# EAGLE design M452sx (EAGLE 6.6.0)
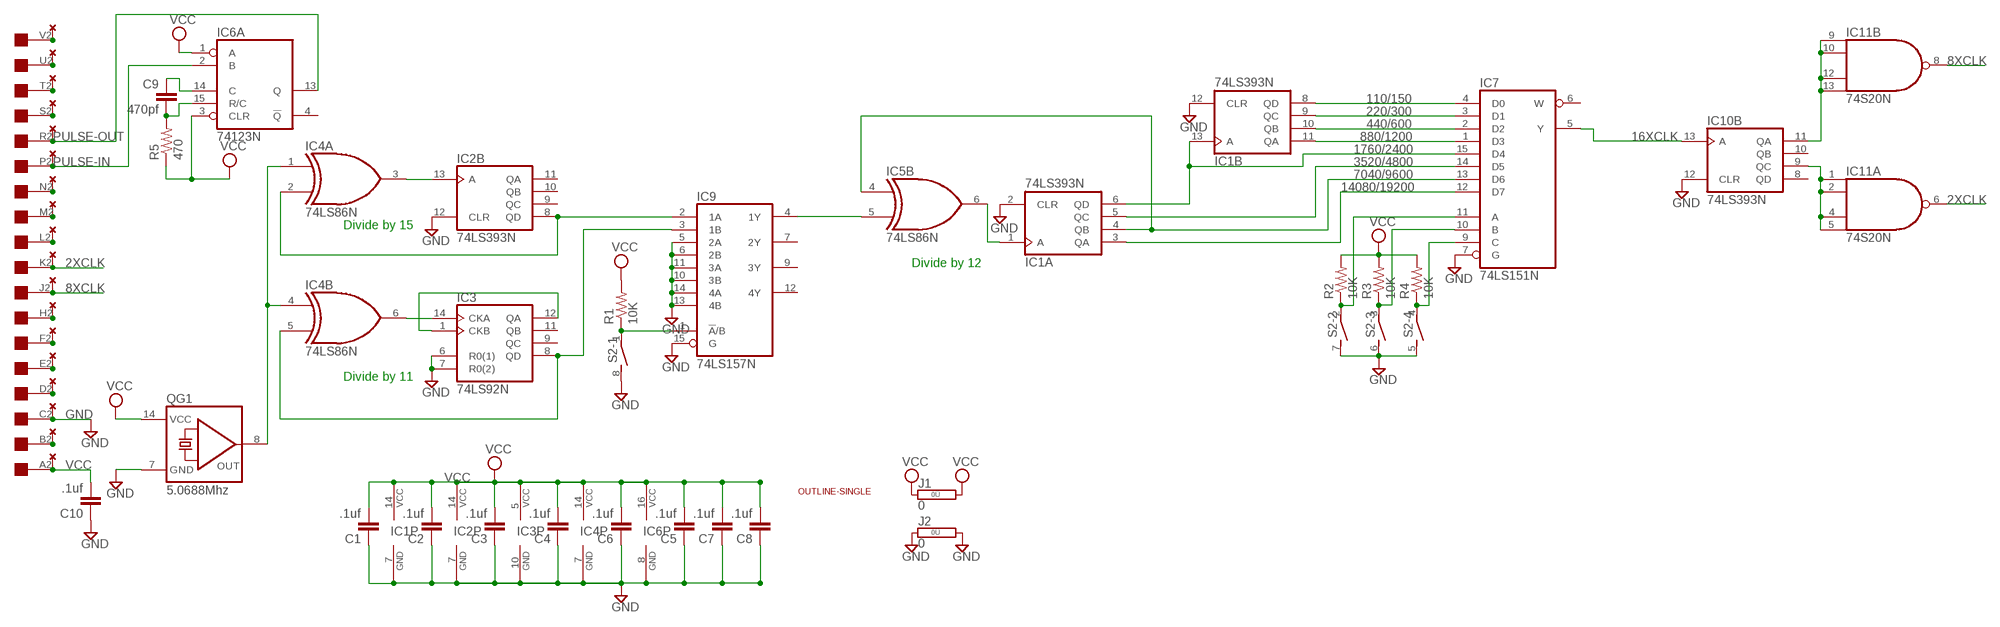
[diagram p0: schematic, sheet 1]

## Parts
C1  .1uf  C-EU050-025X075  [C050-025X075]
C2  .1uf  C-EU050-025X075  [C050-025X075]
C3  .1uf  C-EU050-025X075  [C050-025X075]
C4  .1uf  C-EU050-025X075  [C050-025X075]
C5  .1uf  C-EU050-025X075  [C050-025X075]
C6  .1uf  C-EU050-025X075  [C050-025X075]
C7  .1uf  C-EU050-025X075  [C050-025X075]
C8  .1uf  C-EU050-025X075  [C050-025X075]
C9  470pf  C-EU050-025X075  [C050-025X075]
C10  .1uf  C-EU050-025X075  [C050-025X075]
IC1  74LS393N  [DIL14]
IC2  74LS393N  [DIL14]
IC3  74LS92N  [DIL14]
IC4  74LS86N  [DIL14]
IC5  74LS86N  [DIL14]
IC6  74123N  [DIL16]
IC7  74LS151N  74151N  [DIL16]
IC9  74LS157N  [DIL16]
IC10  74LS393N  [DIL14]
IC11  74S20N  [DIL14]
J1  0  0R  [0R/10]
J2  0  0R  [0R/10]
QG1  5.0688Mhz  QG5860  [DIL14S]
R1  10K  R-US_0204/7  [0204/7]
R2  10K  R-US_0204/7  [0204/7]
R3  10K  R-US_0204/7  [0204/7]
R4  10K  R-US_0204/7  [0204/7]
R5  470  R-US_0204/7  [0204/7]
S2  DIP04S  [DIP04S]
U$2  THRU-HOLE1  [THRU-HOLE1]
U$3  OUTLINE-SINGLE  [SINGLE]
U$4  EDGE-1  [EDGE-CON1]

## Nets
2XCLK: IC11.6(A:O) U$2.K2 U$4.K2
8XCLK: IC11.8(B:O) U$2.J2 U$4.J2
16XCLK: IC7.5(Y) IC10.13(B:A)
110/150: IC1.8(B:QD) IC7.4(D0)
220/300: IC1.9(B:QC) IC7.3(D1)
440/600: IC1.10(B:QB) IC7.2(D2)
880/1200: IC1.11(B:QA) IC7.1(D3)
1760/2400: IC1.6(A:QD) IC1.13(B:A) IC7.15(D4)
3520/4800: IC1.5(A:QC) IC7.14(D5)
7040/9600: IC1.4(A:QB) IC5.4(B:I0) IC7.13(D6)
14080/19200: IC1.3(A:QA) IC7.12(D7)
GND: C1.1 C2.1 C3.1 C4.1 C5.1 C6.1 C7.1 C8.1 C10.1 IC1.2(A:CLR) IC1.7(P:GND) IC1.12(B:CLR) IC2.7(P:GND) IC2.12(B:CLR) IC3.6(R0(1)) IC3.7(R0(2)) IC3.10(GND) IC4.7(P:GND) IC6.8(P:GND) IC7.7(G) IC9.5(2A) IC9.6(2B) IC9.10(3B) IC9.11(3A) IC9.13(4B) IC9.14(4A) IC9.15(G) IC10.12(B:CLR) J2.1 J2.2 QG1.7(GND) S2.5 S2.6 S2.7 S2.8 U$2.C2 U$4.C2
N$1: IC4.1(A:I0) IC4.4(B:I0) QG1.8(OUT)
N$2: IC2.8(B:QD) IC4.2(A:I1) IC9.2(1A)
N$3: IC3.8(QD) IC4.5(B:I1) IC9.3(1B)
N$4: IC3.1(CKB) IC3.12(QA)
N$5: IC3.14(CKA) IC4.6(B:O)
N$6: IC2.13(B:A) IC4.3(A:O)
N$7: U$2.H2 U$4.H2
N$8: IC7.11(A) R2.1 S2.2
N$9: IC5.5(B:I1) IC9.4(1Y)
N$10: IC10.9(B:QC) IC11.1(A:I0) IC11.2(A:I1) IC11.4(A:I2) IC11.5(A:I3)
N$11: IC1.1(A:A) IC5.6(B:O)
N$12: IC10.11(B:QA) IC11.9(B:I0) IC11.10(B:I1) IC11.12(B:I2) IC11.13(B:I3)
N$13: IC7.10(B) R3.1 S2.3
N$14: IC7.9(C) R4.1 S2.4
N$15: U$2.L2 U$4.L2
N$16: U$2.M2 U$4.M2
N$17: IC9.1(!A!/B) R1.1 S2.1
N$18: U$2.N2 U$4.N2
N$19: U$2.F2 U$4.F2
N$20: U$2.E2 U$4.E2
N$21: C9.2 IC6.15(A:R/C) R5.2
N$22: C9.1 IC6.14(A:C)
N$23: U$2.D2 U$4.D2
N$24: U$2.S2 U$4.S2
N$25: U$2.B2 U$4.B2
N$26: U$2.T2 U$4.T2
N$27: U$2.U2 U$4.U2
N$28: U$2.V2 U$4.V2
PULSE-IN: IC6.2(A:B) U$2.P2 U$4.P2
PULSE-OUT: IC6.13(A:Q) U$2.R2 U$4.R2
VCC: C1.2 C2.2 C3.2 C4.2 C5.2 C6.2 C7.2 C8.2 C10.2 IC1.14(P:VCC) IC2.14(P:VCC) IC3.5(VCC) IC4.14(P:VCC) IC6.1(A:A) IC6.3(A:CLR) IC6.16(P:VCC) J1.1 J1.2 QG1.14(VCC) R1.2 R2.2 R3.2 R4.2 R5.1 U$2.A2 U$4.A2
Unconnected: IC2.1(A:A) IC2.2(A:CLR) IC2.3(A:QA) IC2.4(A:QB) IC2.5(A:QC) IC2.6(A:QD) IC2.9(B:QC) IC2.10(B:QB) IC2.11(B:QA) IC3.9(QC) IC3.11(QB) IC4.8(C:O) IC4.9(C:I0) IC4.10(C:I1) IC4.11(D:O) IC4.12(D:I0) IC4.13(D:I1) IC5.1(A:I0) IC5.2(A:I1) IC5.3(A:O) IC5.8(C:O) IC5.9(C:I0) IC5.10(C:I1) IC5.11(D:O) IC5.12(D:I0) IC5.13(D:I1) IC6.4(A:!Q) IC6.5(B:Q) IC6.6(B:C) IC6.7(B:R/C) IC6.9(B:A) IC6.10(B:B) IC6.11(B:CLR) IC6.12(B:!Q) IC7.6(W) IC9.7(2Y) IC9.9(3Y) IC9.12(4Y) IC10.1(A:A) IC10.2(A:CLR) IC10.3(A:QA) IC10.4(A:QB) IC10.5(A:QC) IC10.6(A:QD) IC10.8(B:QD) IC10.10(B:QB)

## Notes on the sheet
- Divide by 15
- Divide by 12
- Divide by 11

## Power pins joined to a net without a drawn wire
GND: IC5.7(P:GND) IC7.8(GND) IC9.8(GND) IC10.7(P:GND) IC11.7(P:GND)
VCC: IC5.14(P:VCC) IC7.16(VCC) IC9.16(VCC) IC10.14(P:VCC) IC11.14(P:VCC)

## Library data of the parts
C1-C10 = rcl:C-EU: CAPACITOR, European symbol
IC1 IC2 IC10 = 74xx-us:74*393: Dual 4-bit decade and binary COUNTER
IC3 = 74xx-us:74*92: Decade, divide by twelve and binary COUNTER
IC4 IC5 = 74xx-us:74*86: Quad 2-input EXCLUSIV-OR (XOR) gate
IC6 = 74xx-us:74*123: Retriggerable monostable MULTIVIBRATOR
IC7 = 74xx-us:74*151: Data SELECTOR/MULTIPLEXER
IC9 = 74xx-us:74*157: Quadruple 2-line to 1-line data SELECTOR/MULTIPLEXER
IC11 = 74xx-us:74*20: Dual 4-input NAND gate
J1 J2 = jumper:0R: Bridge 0R 10mm
QG1 = crystal:QG5860: CRYSTAL RESONATOR; OC_FARNELL: unknown; OC_NEWARK: unknown
R1-R5 = rcl:R-US_: RESISTOR, American symbol
S2 = switch-dil:DIP04S: DIL/CODE SWITCH; OC_FARNELL: unknown; OC_NEWARK: unknown
U$2 = dec-con:THRU-HOLE1: Thru-Hole addition to double-sided edge connector.
U$3 = dec-con:OUTLINE-*: Board outlines for DEC boards.
U$4 = dec-con:EDGE-1: Single-Sided DEC Edge Connector -- (side 2)

## Board
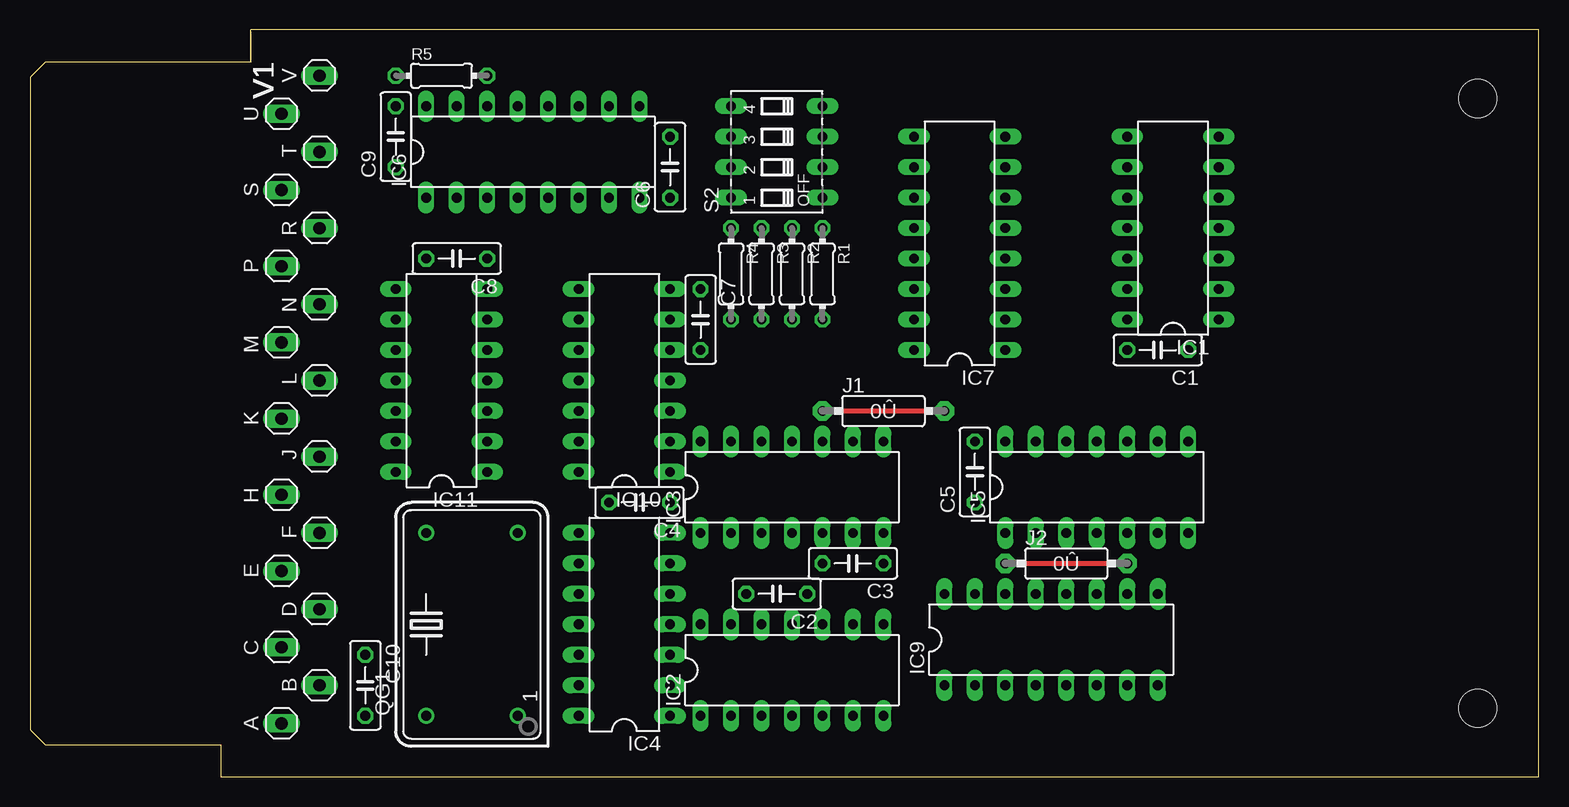
[diagram p1: board, top side]
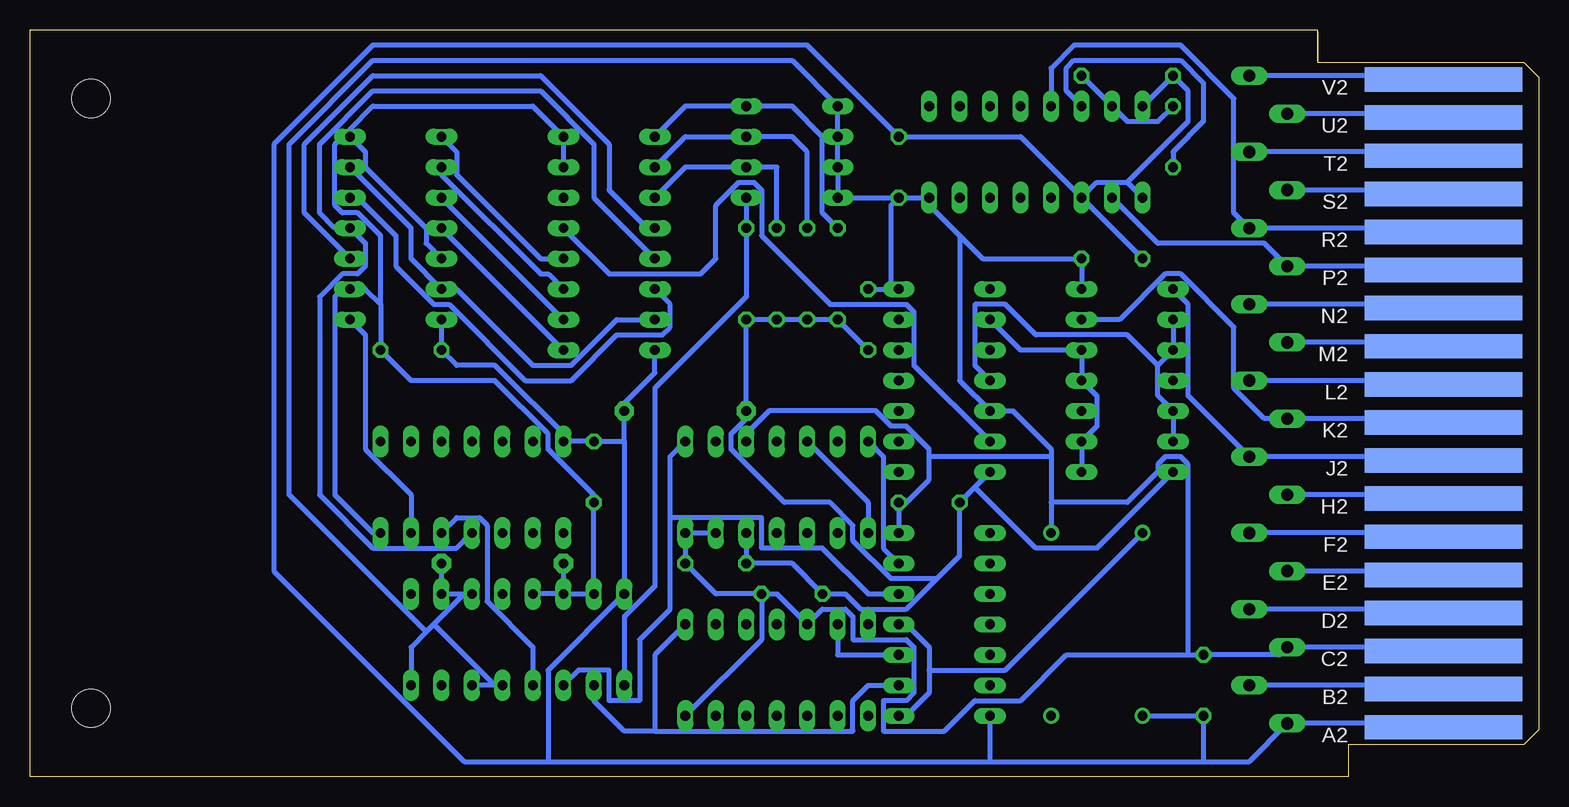
[diagram p2: board, bottom side, seen from below]

Size 125.73 x 62.23 mm. Coordinates in mm from the lower left corner, seen from the top.
Copper layers (1+16): Top 0.035mm / dielectric 1.5mm / Bottom 0.035mm
Design rules "16mils": minimum track width 16mil, minimum drill 32mil, track to track 15mil, track to pad 10mil, pad to pad 10mil, via to via 10mil, smd to smd 10mil, copper to edge 13mil, drill to drill 10mil, minimum pad ring 10mil, minimum via ring 8mil, stop-mask expansion 0mil, vias tented up to drill 0mil, thermal gap 10mil

### Footprints (pad centres in the part's own frame; a part is rotated, then mirrored left to right if it is on the bottom)
C050-025X075 = drill 0.813 octagon: 1 -2.54,0; 2 2.54,0
DIL14 = drill 0.813 long: 1 -7.62,-3.81; 2 -5.08,-3.81; 3 -2.54,-3.81; 4 0,-3.81; 5 2.54,-3.81; 6 5.08,-3.81; 7 7.62,-3.81; 8 7.62,3.81; 9 5.08,3.81; 10 2.54,3.81; 11 0,3.81; 12 -2.54,3.81; 13 -5.08,3.81; 14 -7.62,3.81
DIL16 = drill 0.813 long: 1 -8.89,-3.81; 2 -6.35,-3.81; 3 -3.81,-3.81; 4 -1.27,-3.81; 5 1.27,-3.81; 6 3.81,-3.81; 7 6.35,-3.81; 8 8.89,-3.81; 9 8.89,3.81; 10 6.35,3.81; 11 3.81,3.81; 12 1.27,3.81; 13 -1.27,3.81; 14 -3.81,3.81; 15 -6.35,3.81; 16 -8.89,3.81
0R/10 = drill 0.813 pad 1.6 octagon: 1 -5.08,0; 2 5.08,0
DIL14S = drill 0.813: 1 -7.62,-3.81; 7 7.62,-3.81; 8 7.62,3.81; 14 -7.62,3.81
0204/7 = drill 0.813 octagon: 1 -3.81,0; 2 3.81,0
DIP04S = drill 0.813 long: 1 -3.81,-3.81; 2 -1.27,-3.81; 3 1.27,-3.81; 4 3.81,-3.81; 5 3.81,3.81; 6 1.27,3.81; 7 -1.27,3.81; 8 -3.81,3.81
THRU-HOLE1 = drill 1.016 long: A2 28.575,3.175; B2 25.4,6.35; C2 22.225,3.175; D2 19.05,6.35; E2 15.875,3.175; F2 12.7,6.35; H2 9.525,3.175; J2 6.35,6.35; K2 3.175,3.175; L2 0,6.35; M2 -3.175,3.175; N2 -6.35,6.35; P2 -9.525,3.175; R2 -12.7,6.35; S2 -15.875,3.175; T2 -19.05,6.35; U2 -22.225,3.175; V2 -25.4,6.35
SINGLE = hole 3.175: 120.65,56.515; 120.65,5.715
EDGE-CON1 = smd 13.106 x 2.032 bottom: A2 7.938,4.128; B2 7.938,7.303; C2 7.938,10.477; D2 7.938,13.652; E2 7.938,16.828; F2 7.938,20.003; H2 7.938,23.177; J2 7.938,26.352; K2 7.938,29.527; L2 7.938,32.703; M2 7.938,35.877; N2 7.938,39.053; P2 7.938,42.227; R2 7.938,45.403; S2 7.938,48.578; T2 7.938,51.752; U2 7.938,54.928; V2 7.938,58.102

### Placement (x,y rotation side)
C1  93.98,35.56 180 top
C2  62.23,15.24 180 top
C3  68.58,17.78 180 top
C4  50.8,22.86 180 top
C5  78.74,25.4 90 top
C6  53.34,50.8 90 top
C7  55.88,38.1 270 top
C8  35.56,43.18 180 top
C9  30.48,53.34 90 top
C10  27.94,7.62 270 top
IC1  95.25,45.72 90 top
IC2  63.5,8.89 0 top
IC3  63.5,24.13 0 top
IC4  49.53,12.7 90 top
IC5  88.9,24.13 0 top
IC6  41.91,52.07 0 top
IC7  77.47,44.45 90 top
IC9  85.09,11.43 0 top
IC10  49.53,33.02 90 top
IC11  34.29,33.02 90 top
J1  71.12,30.48 0 top
J2  86.36,17.78 0 top
QG1  36.83,12.7 90 top
R1  66.04,41.91 270 top
R2  63.5,41.91 270 top
R3  60.96,41.91 270 top
R4  58.42,41.91 270 top
R5  34.29,58.42 0 top
S2  62.23,52.07 90 top
U$2  17.78,33.02 270 top
U$3  0,0 0 top
U$4  0,0 0 top

### Tracks (layer width: path | path; a pad name or v marks a point on that pad's centre or on a via)
2XCLK
  Bottom 0.406: U$4.K2 8.26,29.84 U$2.K2 22.86,29.84 25.4,32.38 25.4,37.47 29.85,41.91 31.12,41.91 34.93,38.1 IC11.6
8XCLK
  Bottom 0.406: IC11.8 29.21,39.37 29.21,31.75 U$2.J2 8.26,26.67 U$4.J2
16XCLK
  Bottom 0.406: IC7.5 77.47,41.91 69.85,41.91 68.58,43.18 68.58,47.62 66.68,49.53 65.41,49.53 64.77,48.9 64.77,45.09 59.06,39.37 52.71,39.37 52.07,38.73 52.07,34.29 IC10.13
110/150
  Bottom 0.406: IC7.4 83.19,43.18 90.17,50.16 90.17,52.07 IC1.8
220/300
  Bottom 0.406: IC7.3 82.55,41.91 83.19,41.91 91.44,50.16 IC1.9
440/600
  Bottom 0.406: IC1.10 IC7.2
880/1200
  Bottom 0.406: IC1.11 IC7.1
1760/2400
  Bottom 0.406: IC1.6 93.98,45.72 93.98,43.18 IC1.13 90.17,40.64 83.82,34.29 80.65,34.29 76.84,38.1 IC7.15
3520/4800
  Bottom 0.406: IC1.5 98.43,48.26 95.25,45.09 95.25,42.55 92.08,39.37 90.81,39.37 84.46,33.02 80.65,33.02 76.84,36.83 73.03,36.83 72.39,37.47 72.39,39.37 IC7.14
7040/9600
  Bottom 0.406: IC7.13 78.74,48.26 78.74,52.7 83.19,57.15 97.16,57.15 101.6,52.7 101.6,46.99 100.33,45.72 IC1.4 97.79,44.45 97.79,42.55 98.43,41.91 99.7,41.91 101.6,40.01 101.6,23.5 97.16,19.05 90.17,19.05 IC5.4
14080/19200
  Bottom 0.406: IC7.12 74.3,45.72 77.47,48.9 77.47,52.7 83.19,58.42 97.16,58.42 102.87,52.7 102.87,46.99 IC1.3
GND
  Top 0.406: J2.1 J2.2
  Bottom 0.406: 53.34,22.23 IC4.7 | 40.64,26.67 40.64,27.3 43.82,30.48 IC10.12 48.26,33.02 48.26,45.09 | 40.64,26.67 40.64,22.86 | 40.64,22.86 QG1.7 | IC11.7 C8.1 46.36,43.18 48.26,45.09 | C6.1 51.44,48.26 | 51.44,48.26 48.26,45.09 | 51.44,48.26 IC6.8 | C7.1 53.98,40.64 | C6.1 53.98,47.62 53.98,40.64 | 53.98,40.64 IC10.7 | IC1.12 92.71,44.45 92.71,45.72 97.79,50.8 97.79,52.07 IC1.7 | IC1.7 99.06,53.98 97.16,55.88 83.82,55.88 IC7.8 IC7.7 | U$4.C2 8.26,10.79 U$2.C2 21.59,10.16 C10.1 29.21,10.16 | IC5.7 97.16,20.32 100.33,23.5 100.33,40.01 99.7,40.64 IC1.2 97.79,40.64 96.52,39.37 | 96.52,39.37 C1.1 93.98,33.02 87,33.02 82.55,28.57 82.55,27.3 78.74,23.5 C5.1 IC9.15 IC9.14 | IC3.6 IC3.7 C3.1 68.58,15.24 C2.1 | C2.1 63.5,15.24 IC2.12 59.69,13.97 57.79,13.97 57.15,13.34 57.15,11.43 52.71,11.43 52.07,10.79 52.07,6.99 52.71,6.35 54.61,6.35 54.61,3.81 49.53,3.81 46.99,6.35 43.18,6.35 39.37,10.16 29.21,10.16 | 89.54,15.24 IC9.10 J2.2 | IC9.8 93.98,10.79 92.71,12.06 | 89.54,15.24 92.08,12.7 | 92.08,12.7 92.71,12.06 | 89.54,15.24 IC9.11 | 87,7.62 IC9.6 | 87,7.62 92.08,12.7 | 87,7.62 IC9.5 | IC1.7 99.7,53.34 100.33,52.7 100.33,47.62 99.7,46.99 98.43,46.99 96.52,45.09 96.52,39.37 | 40.64,22.86 34.29,22.86 31.75,25.4 31.75,26.04 31.12,26.67 29.85,26.67 29.21,26.04 29.21,10.16 | IC2.7 64.77,11.43 C2.1 | IC9.14 IC9.13 | 92.71,12.06 104.14,23.5 104.14,52.7 97.16,59.69 62.23,59.69 S2.5 S2.6 S2.7 S2.8 C6.1 | IC3.10 66.04,28.57 64.14,30.48 55.25,30.48 53.98,29.21 52.71,29.21 50.8,27.3 50.8,26.67 | 50.8,26.67 50.8,24.77 53.34,22.23 | 53.34,22.23 C4.1 | 40.64,26.67 50.8,26.67 | J2.1 IC9.14
N$1
  Bottom 0.406: IC4.1 52.71,5.08 50.8,6.99 50.8,8.89 | 50.8,8.89 50.8,10.79 52.71,12.7 IC4.4 | QG1.8 44.45,8.89 50.8,8.89
N$2
  Bottom 0.406: IC4.2 55.88,7.62 57.15,6.35 57.15,3.81 73.66,3.81 | IC2.8 73.66,10.16 73.66,3.81 | IC9.2 78.74,6.35 76.2,3.81 73.66,3.81
N$3
  Bottom 0.406: IC9.3 80.01,8.89 77.47,8.89 77.47,6.35 74.93,6.35 74.93,11.43 72.39,13.97 72.39,21.59 | 72.39,21.59 64.77,21.59 64.77,19.05 59.69,19.05 55.88,15.24 IC4.5 | 72.39,21.59 72.39,26.67 IC3.8
N$4
  Bottom 0.406: IC3.1 55.88,22.86 IC3.12
N$5
  Bottom 0.406: IC4.6 54.61,19.05 54.61,26.67 IC3.14
N$6
  Bottom 0.406: IC4.3 58.42,10.16 IC2.13
N$7
  Bottom 0.406: U$2.H2 8.26,23.5 U$4.H2
N$8
  Bottom 0.406: R2.1 63.5,50.8 S2.2 71.12,50.8 IC7.11
N$9
  Bottom 0.406: IC9.4 83.82,10.79 87.63,14.61 87.63,20.95 88.27,21.59 90.17,21.59 IC5.5
N$10
  Bottom 0.406: IC11.1 IC11.2 36.83,29.21 36.83,31.75 IC11.4 IC11.5 43.18,35.56 IC10.9
N$11
  Bottom 0.406: IC5.6 93.98,23.5 97.79,27.3 97.79,36.83 IC1.1
N$12
  Bottom 0.406: IC11.13 IC11.12 31.75,31.75 31.75,34.29 | IC11.9 IC11.10 31.75,34.29 | 31.75,34.29 34.29,36.83 41.91,36.83 44.45,39.37 46.99,39.37 46.99,34.29 IC10.11
N$13
  Bottom 0.406: IC7.10 71.12,53.34 S2.3 62.23,53.34 60.96,52.07 R3.1
N$14
  Bottom 0.406: IC7.9 71.12,55.88 S2.4 62.23,55.88 59.69,53.34 59.69,46.99 R4.1
N$15
  Bottom 0.406: U$2.L2 8.26,33.02 U$4.L2
N$16
  Bottom 0.406: U$2.M2 8.26,36.2 U$4.M2
N$17
  Bottom 0.406: S2.1 R1.1 66.04,40.01 73.66,32.38 73.66,15.88 76.2,13.34 IC9.1
N$18
  Bottom 0.406: U$2.N2 8.26,39.37 U$4.N2
N$19
  Bottom 0.406: U$2.F2 8.26,20.32 U$4.F2
N$20
  Bottom 0.406: U$2.E2 8.26,17.14 U$4.E2
N$21
  Bottom 0.406: C9.2 31.75,54.61 34.29,54.61 IC6.15 R5.2
N$22
  Bottom 0.406: C9.1 30.48,52.07 27.94,54.61 27.94,57.78 29.85,59.69 38.74,59.69 39.37,59.05 39.37,57.15 IC6.14
N$23
  Bottom 0.406: U$2.D2 8.26,13.97 U$4.D2
N$24
  Bottom 0.406: U$2.S2 8.26,48.9 U$4.S2
N$25
  Bottom 0.406: U$2.B2 8.26,7.62 U$4.B2
N$26
  Bottom 0.406: U$2.T2 8.26,52.07 U$4.T2
N$27
  Bottom 0.406: U$2.U2 8.26,55.24 U$4.U2
N$28
  Bottom 0.406: U$2.V2 8.26,58.42 U$4.V2
PULSE-IN
  Bottom 0.406: IC6.2 31.75,44.45 22.86,44.45 U$2.P2 8.26,42.55 U$4.P2
PULSE-OUT
  Bottom 0.406: IC6.13 40.64,59.05 38.74,60.96 29.85,60.96 25.4,56.52 25.4,46.99 U$2.R2 8.26,45.72 U$4.R2
VCC
  Top 0.406: J1.1 J1.2
  Bottom 0.406: IC6.16 R5.1 29.21,57.15 29.21,54.61 34.29,49.53 | IC6.3 C8.2 | 34.29,49.53 IC6.1 | 34.29,49.53 36.83,49.53 IC6.3 | IC6.3 43.18,53.34 C6.2 60.96,60.96 97.16,60.96 105.41,52.7 105.41,17.14 89.54,1.27 82.55,1.27 | 46.99,24.13 C4.2 48.26,18.41 50.17,16.51 | 46.99,24.13 IC10.14 | IC3.5 C3.2 62.23,17.78 C2.2 57.79,15.24 56.52,13.97 55.88,13.97 | 55.88,13.97 IC2.14 | 50.17,16.51 52.71,13.97 55.88,13.97 | QG1.14 C10.2 | 45.72,1.27 IC4.14 | 46.99,24.13 41.91,19.05 36.83,19.05 IC11.14 | 50.17,16.51 53.98,16.51 57.15,19.68 57.15,20.95 59.06,22.86 62.87,22.86 67.31,27.3 67.31,28.57 66.04,29.84 J1.1 R1.2 R2.2 R3.2 R4.2 C7.2 | IC1.14 C1.2 90.17,34.29 87,34.29 80.65,27.94 | 76.2,27.94 IC9.16 82.55,8.89 82.55,1.27 | 76.2,27.94 C5.2 80.65,27.94 | IC7.16 73.66,33.66 76.2,31.11 J1.2 76.2,27.94 | 80.65,27.94 IC5.14 | U$4.A2 8.26,4.45 U$2.A2 24.13,1.27 27.94,1.27 | 27.94,4.45 C10.2 | 82.55,1.27 45.72,1.27 | 45.72,1.27 27.94,1.27 | C10.2 27.94,1.27

### Text on the board
tNames: V1 | V1 | V1 | V1 | V1 | V1 | V1 | V1 | V1 | V1 | V1 | V1 | V1 | V1 | V1 | V1 | V1 | V1 | V1 | V1 | V1 | V1 | V1 | V1 | V1 | V1 | V1 | V1 | V1 | V1 | V1 | V1